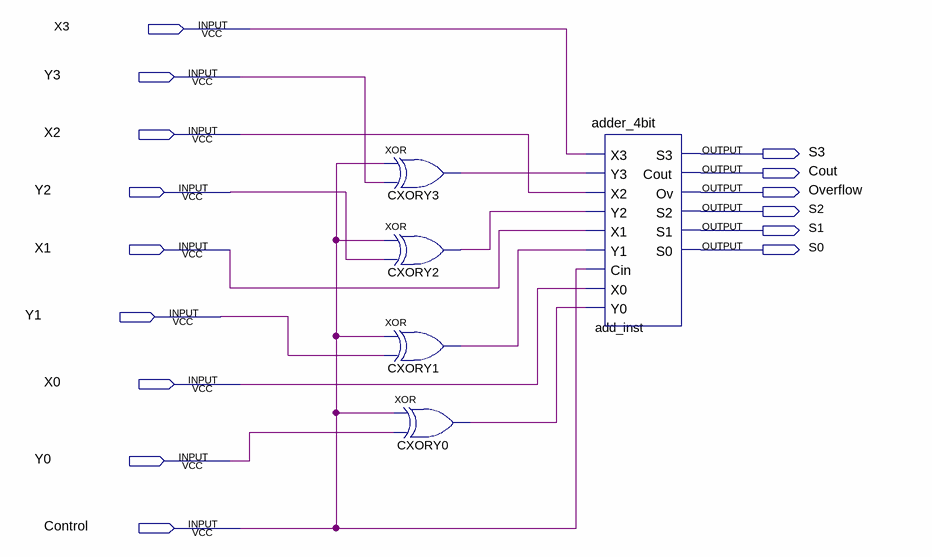
[diagram p0: schematic sheet]
// Quartus schematic adder-subtractor.bdf as structural Verilog: 5 symbols, 15 pins
module \adder-subtractor  (
  input  X3,
  input  Y3,
  input  X2,
  input  Y2,
  input  X1,
  input  Y1,
  input  X0,
  input  Y0,
  input  Control,
  output S3,
  output Cout,
  output Overflow,
  output S2,
  output S1,
  output S0
);

  wire CXORY0_out, CXORY1_out, CXORY2_out, CXORY3_out;

  xor CXORY3 (CXORY3_out, Control, Y3);
  xor CXORY2 (CXORY2_out, Control, Y2);
  xor CXORY1 (CXORY1_out, Control, Y1);
  xor CXORY0 (CXORY0_out, Control, Y0);
  adder_4bit add_inst (
    .X3(X3), .Y3(CXORY3_out), .X2(X2), .Y2(CXORY2_out), .X1(X1), .Y1(CXORY1_out), .Cin(Control), .X0(X0),
    .Y0(CXORY0_out), .S3(S3), .Cout(Cout), .Ov(Overflow), .S2(S2), .S1(S1), .S0(S0));
endmodule
